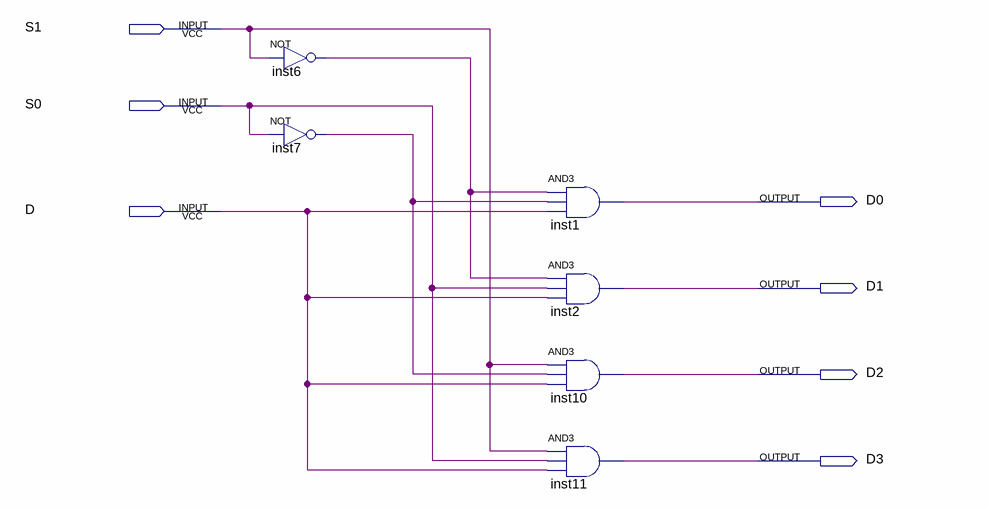
[diagram p0: schematic sheet]
// Quartus schematic demultiplexador.bdf as structural Verilog: 6 symbols, 7 pins
module demultiplexador (
  input  S1,
  input  S0,
  input  D,
  output D0,
  output D1,
  output D2,
  output D3
);

  wire inst6_out, inst7_out;

  not inst6 (inst6_out, S1);
  not inst7 (inst7_out, S0);
  and inst1 (D0, inst6_out, inst7_out, D);
  and inst2 (D1, inst6_out, S0, D);
  and inst10 (D2, S1, inst7_out, D);
  and inst11 (D3, S1, S0, D);
endmodule
